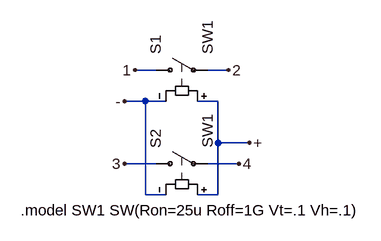
[diagram p0: schematic DPST-NO.asc]
DPST-NO.asc, the LTspice schematic file:
Version 4
SHEET 1 884 680
WIRE 208 80 176 80
WIRE 320 80 288 80
WIRE 192 128 160 128
WIRE 224 128 192 128
WIRE 304 128 272 128
WIRE 304 192 304 128
WIRE 352 192 304 192
WIRE 208 224 160 224
WIRE 336 224 288 224
WIRE 192 272 192 128
WIRE 224 272 192 272
WIRE 304 272 304 192
WIRE 304 272 272 272
FLAG 176 80 1
FLAG 320 80 2
FLAG 160 224 3
FLAG 336 224 4
FLAG 352 192 +
FLAG 160 128 -
SYMBOL sw 192 80 R270
SYMATTR InstName S1
SYMATTR Value SW1
SYMBOL sw 192 224 R270
SYMATTR InstName S2
SYMATTR Value SW1
TEXT 0 296 Left 2 !.model SW1 SW(Ron=25u Roff=1G Vt=.1 Vh=.1)

The netlist it stands for:
* DPST-NO.asc
S1 1 2 + - SW1
S2 3 4 + - SW1
.model SW1 SW(Ron=25u Roff=1G Vt=.1 Vh=.1)
.backanno
.end